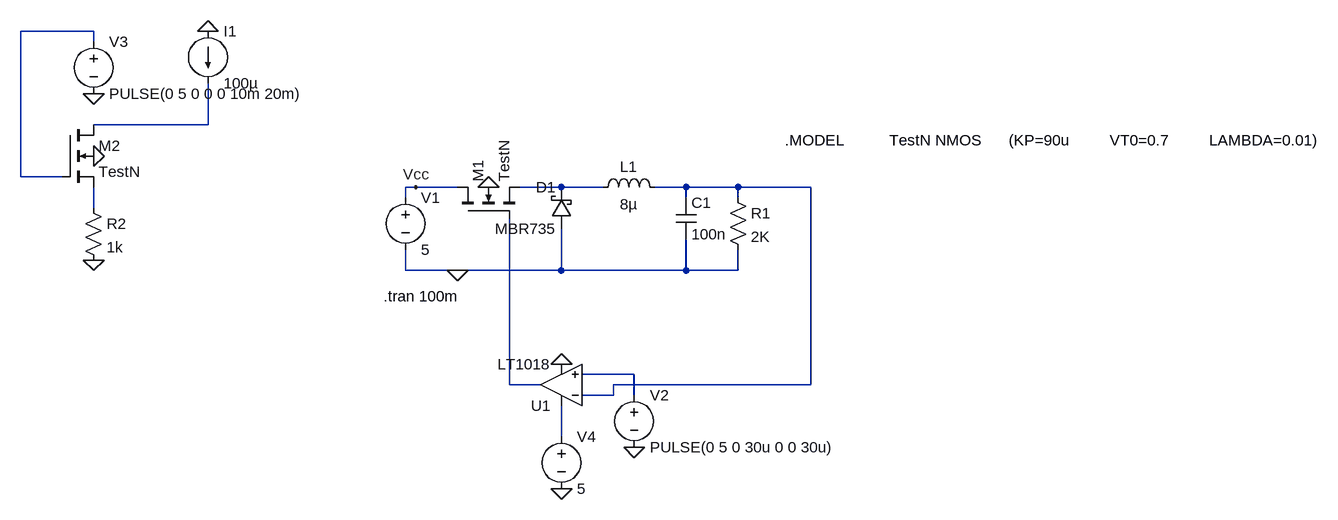
[diagram p0: schematic buck_cf.asc]
buck_cf.asc, the LTspice schematic file:
Version 4
SHEET 1 1364 680
WIRE -640 -144 -752 -144
WIRE -640 -128 -640 -144
WIRE -464 0 -464 -64
WIRE -464 0 -640 0
WIRE -752 80 -752 -144
WIRE -688 80 -752 80
WIRE -144 96 -160 96
WIRE -80 96 -144 96
WIRE 80 96 16 96
WIRE 144 96 80 96
WIRE 272 96 224 96
WIRE 352 96 272 96
WIRE 464 96 352 96
WIRE -160 112 -160 96
WIRE 272 112 272 96
WIRE 352 112 352 96
WIRE -640 128 -640 96
WIRE -160 224 -160 192
WIRE -80 224 -160 224
WIRE 80 224 80 160
WIRE 80 224 -80 224
WIRE 272 224 272 176
WIRE 272 224 80 224
WIRE 352 224 352 192
WIRE 352 224 272 224
WIRE 192 384 112 384
WIRE 0 400 0 144
WIRE 48 400 0 400
WIRE 464 400 464 96
WIRE 464 400 160 400
WIRE 160 416 160 400
WIRE 160 416 112 416
WIRE 192 416 192 384
WIRE 80 480 80 432
FLAG -80 224 0
FLAG -464 -144 0
FLAG -640 -48 0
FLAG -640 48 0
FLAG -640 208 0
FLAG -32 96 0
FLAG 192 496 0
FLAG 80 368 0
FLAG -144 96 Vcc
FLAG 80 560 0
SYMBOL ind 128 112 R270
WINDOW 0 32 56 VTop 2
WINDOW 3 5 56 VBottom 2
SYMATTR InstName L1
SYMATTR Value 8µ
SYMBOL cap 256 112 R0
SYMATTR InstName C1
SYMATTR Value 100n
SYMBOL res 336 96 R0
SYMATTR InstName R1
SYMATTR Value 2K
SYMBOL schottky 96 160 R180
WINDOW 0 24 64 Left 2
WINDOW 3 24 0 Left 2
SYMATTR InstName D1
SYMATTR Value MBR735
SYMATTR Description Diode
SYMATTR Type diode
SYMBOL nmos4 -80 144 R270
SYMATTR InstName M1
SYMATTR Value TestN
SYMATTR Value2 l=1.8u w=30u
SYMBOL voltage -160 96 R0
WINDOW 123 0 0 Left 2
WINDOW 39 0 0 Left 2
SYMATTR InstName V1
SYMATTR Value 5
SYMBOL voltage -640 -144 R0
WINDOW 123 0 0 Left 2
WINDOW 39 0 0 Left 2
SYMATTR InstName V3
SYMATTR Value PULSE(0 5 0 0 0 10m 20m)
SYMBOL nmos4 -688 0 R0
SYMATTR InstName M2
SYMATTR Value TestN
SYMATTR Value2 l=2u w=20u
SYMBOL current -464 -144 R0
WINDOW 123 0 0 Left 2
WINDOW 39 0 0 Left 2
SYMATTR InstName I1
SYMATTR Value 100µ
SYMBOL res -656 112 R0
SYMATTR InstName R2
SYMATTR Value 1k
SYMBOL Comparators\\LT1018 80 400 R180
SYMATTR InstName U1
SYMBOL voltage 192 400 R0
WINDOW 123 0 0 Left 2
WINDOW 39 0 0 Left 2
SYMATTR InstName V2
SYMATTR Value PULSE(0 5 0 30u 0 0 30u)
SYMBOL voltage 80 464 R0
WINDOW 123 0 0 Left 2
WINDOW 39 0 0 Left 2
SYMATTR InstName V4
SYMATTR Value 5
TEXT -194 264 Left 2 !.tran 100m
TEXT 424 24 Left 2 !.MODEL          TestN NMOS      (KP=90u         VT0=0.7         LAMBDA=0.01)

The netlist it stands for:
* buck_cf.asc
L1 N003 N004 8µ
C1 N004 0 100n
R1 N004 0 2K
D1 0 N003 MBR735
M1 Vcc N007 N003 0 TestN l=1.8u w=30u
V1 Vcc 0 5
V3 N001 0 PULSE(0 5 0 0 0 10m 20m)
M2 N002 N001 N005 0 TestN l=2u w=20u
I1 0 N002 100µ
R2 N005 0 1k
XU1 N006 N004 N008 0 N007 LT1018  ; pins In+ In- V+ V- OUT
V2 N006 0 PULSE(0 5 0 30u 0 0 30u)
V4 N008 0 5
.model D D
.lib standard.dio
.model NMOS NMOS
.model PMOS PMOS
.lib standard.mos
.tran 100m
.MODEL          TestN NMOS      (KP=90u         VT0=0.7         LAMBDA=0.01)
.lib LTC1.lib
.backanno
.end